# Altium project HV_Board.PrjPcb
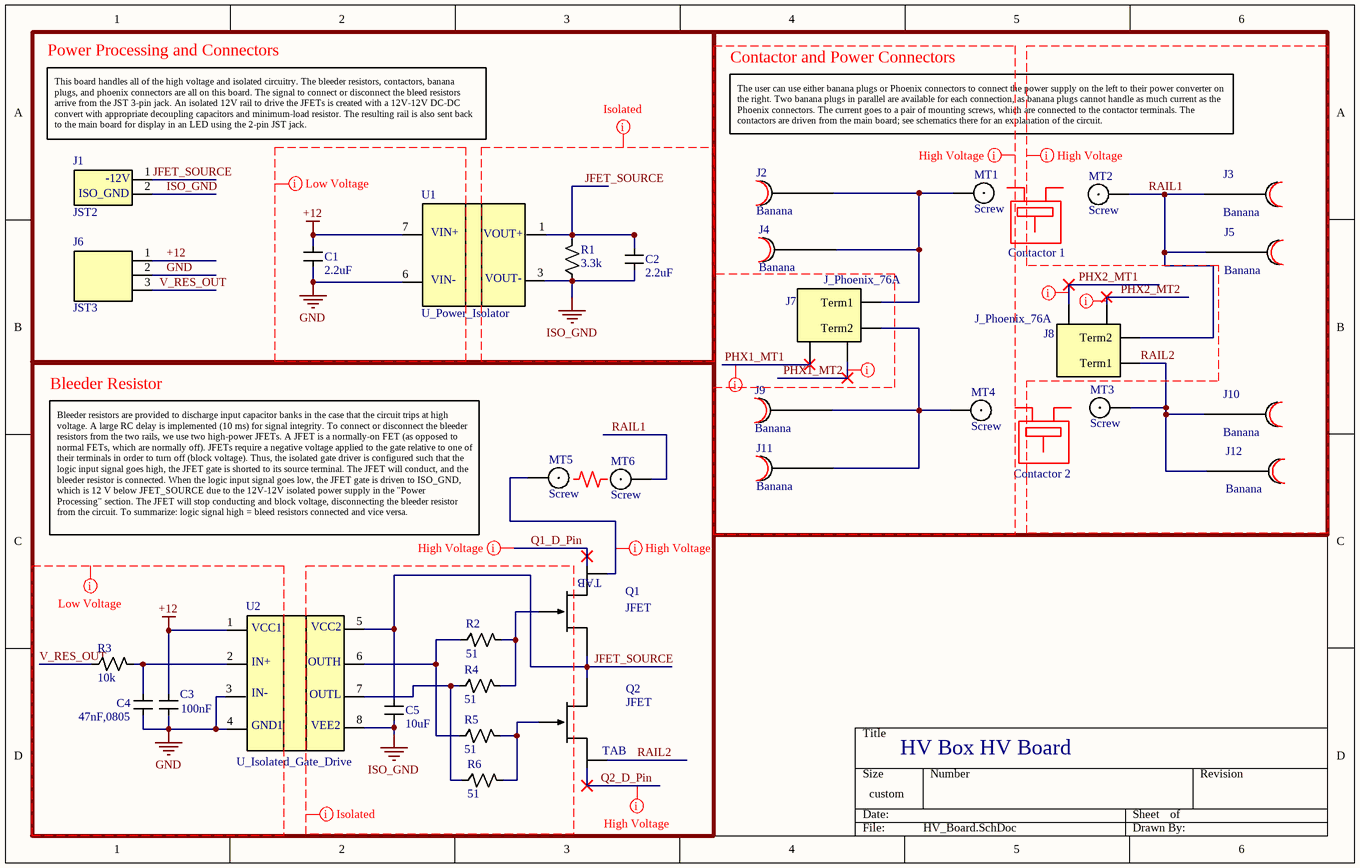
[diagram p0: HV_Board.SchDoc]
1 sheet, 33 parts. Net scope: global (net labels, ports and power ports of the same name join across sheets).
Board file: HV_Board_PCB.PcbDoc

## Sheet HV_Board.SchDoc
size 254 x 161 mm; SheetNumber: 1; SheetTotal: 1

### Parts
C1  2.2uF  [0603_CAP]
C2  2.2uF  [0603_CAP]
C3  100nF  [0603_CAP]
C4  47nF,0805  [0805_CAP]
C5  10uF  [0805_CAP]
J1  JST2  [JST_2]
J2  Banana  [BANANA_PLUG]
J3  Banana  [BANANA_PLUG]
J4  Banana  [BANANA_PLUG]
J5  Banana  [BANANA_PLUG]
J6  JST3  [JST_3]
J7  J_Phoenix_76A  [PHOENIX_CONNECTOR_76A]
J8  J_Phoenix_76A  [PHOENIX_CONNECTOR_76A]
J9  Banana  [BANANA_PLUG]
J10  Banana  [BANANA_PLUG]
J11  Banana  [BANANA_PLUG]
J12  Banana  [BANANA_PLUG]
MT1  Screw  [MOUNT_SMALL]
MT2  Screw  [MOUNT_SMALL]
MT3  Screw  [MOUNT_SMALL]
MT4  Screw  [MOUNT_SMALL]
MT5  Screw  [MOUNT_SMALL]
MT6  Screw  [MOUNT_SMALL]
Q1  JFET  [TO247]
Q2  JFET  [TO247]
R1  3.3k  [0603_RES]
R2  51  [0603_RES]
R3  10k  [0603_RES]
R4  51  [0603_RES]
R5  51  [0603_RES]
R6  51  [0603_RES]
U1  U_Power_Isolator  [SIP7]
U2  U_Isolated_Gate_Drive  [GATE_DRIVER]

### Blocks framed on the sheet
Power Processing and Connectors: C1 C2 J1 J6 R1 U1
Contactor and Power Connectors: J2-J5 J7-J12 MT1-MT4
Bleeder Resistor: C3-C5 MT5 MT6 Q1 Q2 R2-R6 U2

### Nets
+12: C1.2 C3.2 J6.1(Sig1) U1.7(Vin+) U2.1(VCC1)
GND: C1.1 C3.1 C4.1 J6.2(Sig2) U1.6(VIN-) U2.3(IN-) U2.4(GND1)
ISO_GND: C2.1 C5.1 J1.2(Sig2) R1.1 U1.3(VOUT-) U2.8(VEE2)
JFET_SOURCE: C2.2 C5.2 J1.1(Sig1) Q1.3(S) Q2.3(S) R1.2 U1.1(VOUT+) U2.5(VCC2)
PHX1_MT1: J7.3(Mt1)
PHX1_MT2: J7.4(Mt2)
PHX2_MT1: J8.3(Mt1)
PHX2_MT2: J8.4(Mt2)
Q1_D_Pin: Q1.2(D)
Q2_D_Pin: Q2.2(D)
RAIL1: J3.1(Plug) J5.1(Plug) J8.2(Term2) MT2.1 MT6.1
RAIL2: J8.1(Term1) J10.1(Plug) J12.1(Plug) MT3.1 Q2.4(TAB)
V_RES_OUT: J6.3(NC) R3.1
NetC4_2: C4.2 R3.2 U2.2(IN+)
NetJ2_1: J2.1(Plug) J4.1(Plug) J7.1(Term1) MT1.1
NetJ7_2: J7.2(Term2) J9.1(Plug) J11.1(Plug) MT4.1
NetMT5_1: MT5.1 Q1.4(TAB)
NetQ1_1: Q1.1(G) R2.2 R4.2
NetQ2_1: Q2.1(G) R5.2 R6.2
NetR2_1: R2.1 R5.1 U2.6(OUTH)
NetR4_1: R4.1 R6.1 U2.7(OUTL)

### Layout directives
net class Isolated: ISO_GND, JFET_SOURCE
net class Low Voltage: +12, GND, PHX1_MT1, PHX1_MT2, PHX2_MT1, PHX2_MT2, V_RES_OUT
net class High Voltage: NetMT5_1, PHX1_MT1, PHX1_MT2, PHX2_MT1, PHX2_MT2, Q1_D_Pin, Q2_D_Pin, RAIL1, RAIL2

### Notes on the sheet
- (near J1) This board handles all of the high voltage and isolated circuitry. The bleeder resistors, contactors, banana plugs, and phoenix connectors are all on this board. The signal to connect or disconnect the bleed resistors arrive from the JST 3-pin jack. An isolated 12V rail to drive the JFETs is created with a 12V-12V DC-DC convert with appropriate decoupling capacitors and minimum-load resistor. The resulting rail is also sent back to the main board for display in an LED using the 2-pin JST jack.
- The user can use either banana plugs or Phoenix connectors to connect the power supply on the left to their power converter on the right. Two banana plugs in parallel are available for each connection, as banana plugs cannot handle as much current as the Phoenix connectors. The current goes to a pair of mounting screws, which are connected to the contactor terminals. The contactors are driven from the main board; see schematics there for an explanation of the circuit.
- Contactor 1
- Contactor 2
- Bleeder resistors are provided to discharge input capacitor banks in the case that the circuit trips at high voltage. A large RC delay is implemented (10 ms) for signal integrity. To connect or disconnect the bleeder resistors from the two rails, we use two high-power JFETs. A JFET is a normally-on FET (as opposed to normal FETs, which are normally off). JFETs require a negative voltage applied to the gate relative to one of their terminals in order to turn off (block voltage). Thus, the isolated gate driver is configured such that the logic input signal goes high, the JFET gate is shorted to its source terminal. The JFET will conduct, and the bleeder resistor is connected. When the logic input signal goes low, the JFET gate is driven to ISO_GND, which is 12 V below JFET_SOURCE due to the 12V-12V isolated power supply in the "Power Processing" section. The JFET will stop conducting and block voltage, disconnecting the bleeder resistor from the circuit. To summarize: logic signal high = bleed resistors connected and vice versa.
- HV Box HV Board
- (in symbol J_JST_2) -12V; ISO_GND
- (in symbol U_12_12_Power_Isolator) VIN+

### Library data of the parts
C1 C2 = C_2.2uF_0603: Capacitor SMD MLCC 2.2 uF 0603
C3 = C_100nF_0603: Capacitor SMD MLCC 100 nF 0603
C4 = C_47nF_0805: Capacitor SMD MLCC 47 nF 0805, C0G/NP0
C5 = C_10uF_0805: Capacitor SMD MLCC 10 uF 0805
J1 = J_JST_2: Jack JST 2-pin
J2-J5 J9-J12 = J_Banana: Banana Plug
J6 = J_JST_3: Jack JST 3-pin
J7 J8 = J_Phoenix_76A: Phoenix Connector, Female, 2 position, 76 A, 1 kV per position
MT1-MT6 = MT_Screw_Small: M5/M6 Screw Mount for connecting board to resistors
Q1 Q2 = Q_JFET: N-Channel JFET1200 V 34 A TO 247-3
R1 = R_3300Ohm_0603_1%: Resistor 3.3 kOhm 0603 1%
R2 R4-R6 = R_51Ohm_0603_1%: Resistor 51 Ohm 0603 1%
R3 = R_10kOhm_0603_1%: Resistor 10 kOhm 0603 1%
U1 = U_12_12_Power_Isolator: 12 V -> 12 V DC-DC isolated converter, 84 mW output current, SIP7 4-lead package, 3 kV isolation
U2 = U_Isolated_Gate_Drive: IC Isolated Gate Drive 3-15 V Output Supply Split Output